# Altium project ZLS_MCU_New.PrjPCB (part 4 of 4)

## Sheet Copy of USB.SchDoc: USB
size A4; DocumentNumber: MB1137; Revision: B-01; SheetNumber: 4; SheetTotal: 6; Project: NUCLEO-XXXXZX
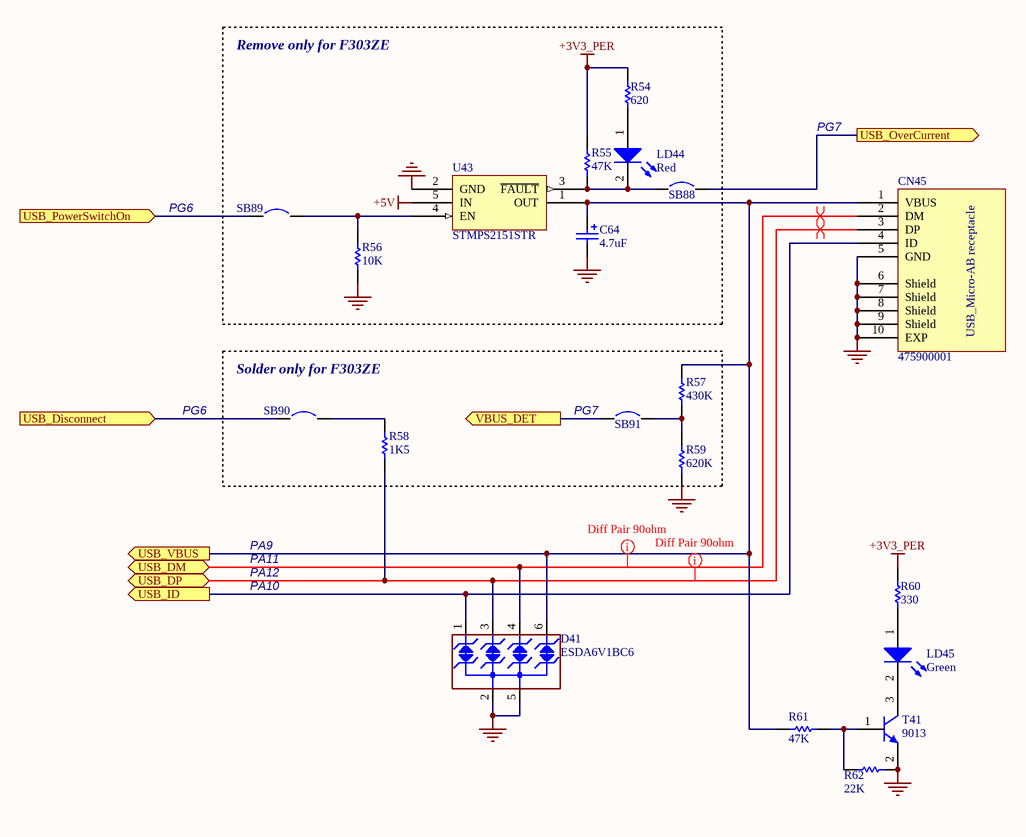
[diagram p9: Copy of USB.SchDoc]

### Parts
C64  4.7uF  [TAN-A]
CN45  475900001  [MOLEX_47590001]
D41  ESDA6V1BC6  [SOT23-6L]
LD44  Red  [0603D-R]
LD45  Green  [0603D-G]
R54  620  [0603R]
R55  47K  [0603R]
R56  10K  [0603R]
R57  430K  [0603R]
R58  1K5  [0603R]
R59  620K  [0603R]
R60  330  [0603R]
R61  47K  [0603R]
R62  22K  [0603R]
SB88  Circuit Breaker  [SB_0603]  (value not drawn)
SB89  Circuit Breaker  [SB_0603]  (value not drawn)
SB90  Circuit Breaker  [SB_0603]  (value not drawn)
SB91  Circuit Breaker  [SB_0603]  (value not drawn)
T41  9013  [SOT-23]
U43  STMPS2151STR  [SOT-23-5L]

### Blocks framed on the sheet
Remove only for F303ZE: C64 LD44 R54-R56 SB88 SB89 U43
Solder only for F303ZE: R57-R59 SB90 SB91

### Ports
USB_Disconnect (in), USB_DM (bidir), USB_DP (bidir), USB_ID (out), USB_OverCurrent (out), USB_PowerSwitchOn (in), USB_VBUS (out), VBUS_DET (out)

### Nets
+3V3_PER: R54.2 R55.1 R60.2
+5V: U43.5(IN)
GND: C64.2 CN45.5(GND) CN45.6(Shield) CN45.7(Shield) CN45.8(Shield) CN45.9(Shield) CN45.10(EXP) D41.2(IO2) D41.5(IO4) R56.1 R59.2 R62.1 T41.2(E) U43.2(GND)
NetC64_1: C64.1 CN45.1(VBUS) D41.6(NC) R57.1 R61.1 U43.1(OUT) ; port USB_VBUS
NetCN45_2: CN45.2(DM) D41.4(IO3) ; port USB_DM
NetCN45_3: CN45.3(DP) D41.3(GND) R58.1 ; port USB_DP
NetCN45_4: CN45.4(ID) D41.1(IO1) ; port USB_ID
NetLD44_1: LD44.1(A) R54.1
NetLD44_2: LD44.2(K) R55.2 SB88.1 U43.3(~{FAULT})
NetLD45_1: LD45.1(A) R60.1
NetLD45_2: LD45.2(K) T41.3(C)
NetR56_2: R56.2 SB89.2 U43.4(EN)
NetR57_2: R57.2 R59.1 SB91.2
NetR58_2: R58.2 SB90.2
NetR61_2: R61.2 R62.2 T41.1(B)
NetSB88_2: SB88.2 ; port USB_OverCurrent
NetSB89_1: SB89.1 ; port USB_PowerSwitchOn
NetSB90_1: SB90.1 ; port USB_Disconnect
NetSB91_1: SB91.1 ; port VBUS_DET

### Layout directives
mark named Diff Pair 90ohm: NetCN45_2, NetCN45_3
differential pair: NetCN45_2, NetCN45_3

### Notes on the sheet
- PG7
- PG6
- (near SB91) PG7
- PA9
- PA12
- PA11
- PA10
- Title:
- Project:
- Size:
- Date:
- A4
- Reference:
- Sheet:
- Revision:
- of
- (in symbol 475900001) USB_Micro-AB receptacle

### Library data of the parts
C64 = Cap Pol1: Polarized Capacitor (Radial); Value: 47uF; Published: 8-Jun-2000; Revision: July-2002: Re-released for DXP Platform.; Publisher: Altium Limited
D41 = ESDA6V1BC6: 4-line ESD protection; Manuf_1: STM; Manuf_Part_1: ESDA5V3L; Ref St: 9179034; Provided: ST; ECCN_US/EU: EAR99/NEC; Distrib: ST; Order: ESDA5V3L; Ordered by: STM
LD44 LD45 = LED2: Typical RED, GREEN, YELLOW, AMBER GaAs LED; Published: 8-Jun-2000; Revision: July-2002: Re-released for DXP Platform.; Publisher: Altium Limited
R54 R56 = Res1: Resistor; Value: 1K; Published: 8-Jun-2000; Revision: July-2002: Re-released for DXP Platform.; Publisher: Altium Limited
R55 R57 R59-R62 = res1: Resistor; Value: 1K; Published: 8-Jun-2000; Revision: July-2002: Re-released for DXP Platform.; Publisher: Altium Limited
R58 = Resistor_ST: Resistor 0402 / 0603 / 0805; Value: 10K
SB88-SB91 = Circuit Breaker: Solder: NO; Published: 24-Mar-1999; Revision: July-2002: Re-released for DXP Platform.; Publisher: Altium Limited
T41 = NPN: NPN Bipolar Transistor; Code - JEDEC: TO-226-AA; Published: 8-Jun-2000; Revision: July-2002: Re-released for DXP Platform.; Publisher: Altium Limited
U43 = STMPS2141STR

## Sheet Copy of ST_LINK_V2-1.SCHDOC: STLINK/V2-1
size A4; DocumentNumber: MB1137; Revision: B-01; SheetNumber: 3; SheetTotal: 6; Project: NUCLEO-XXXXZX
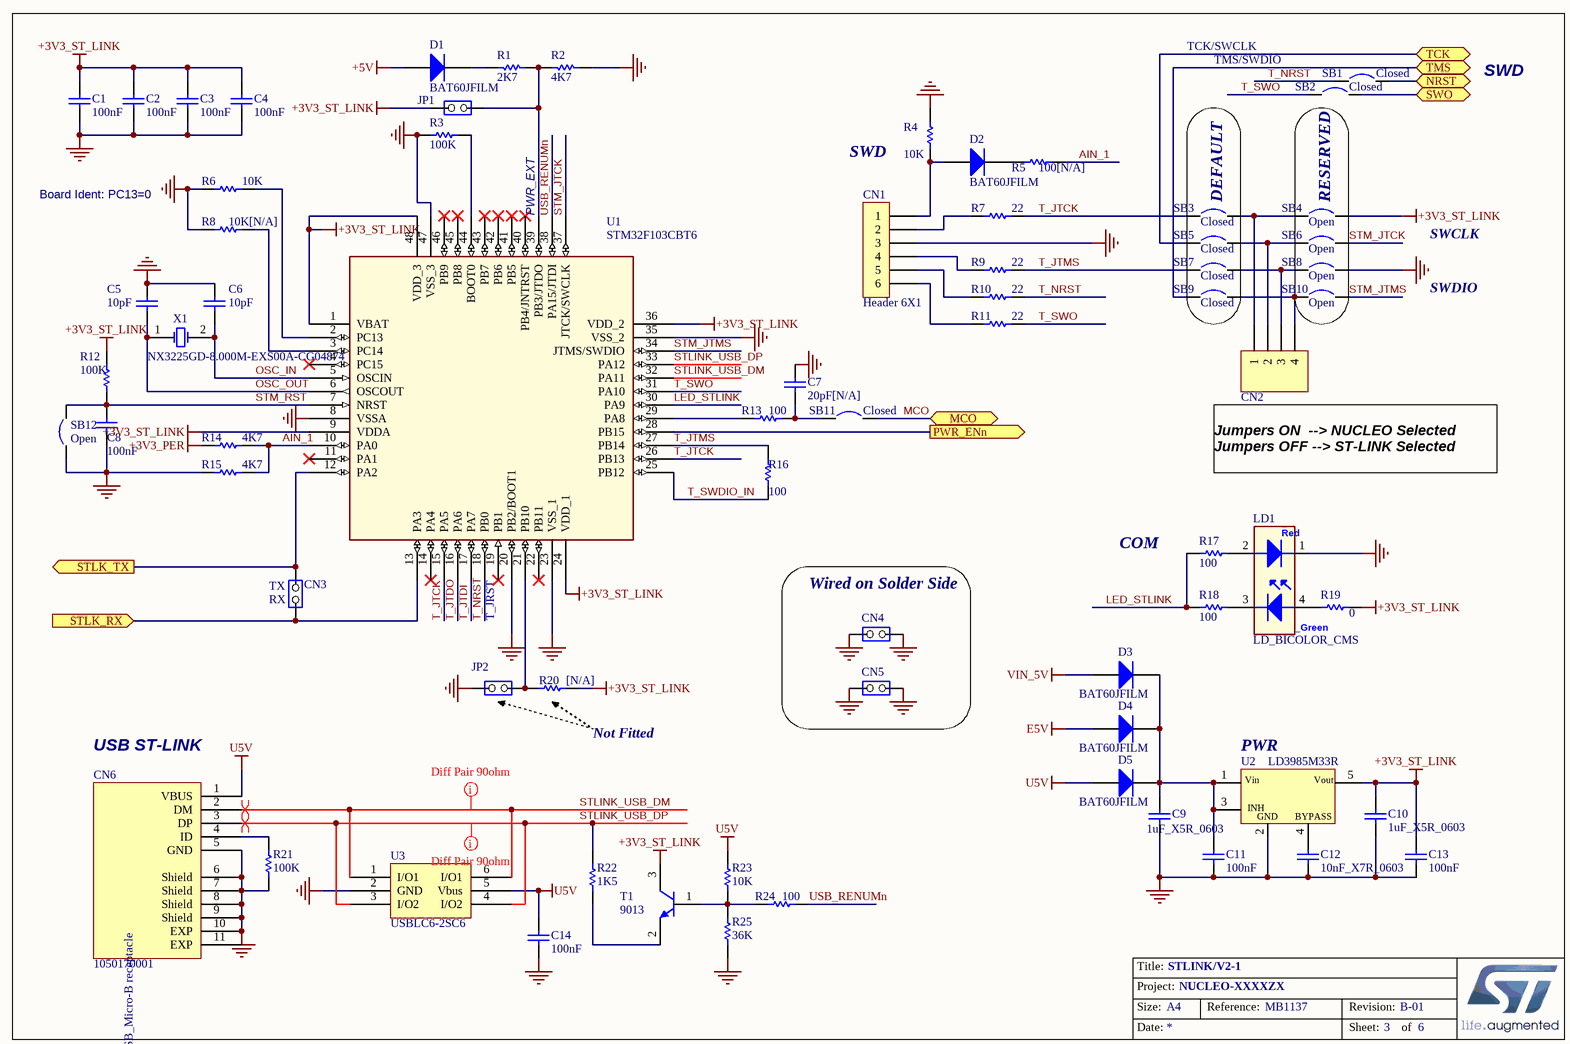
[diagram p10: Copy of ST_LINK_V2-1.SCHDOC]

### Parts
C1  100nF  [0603C]
C2  100nF  [0603C]
C3  100nF  [0603C]
C4  100nF  [0603C]
C5  10pF  [0603C]
C6  10pF  [0603C]
C7  20pF[N/A]  [0603C]
C8  100nF  [0603C]
C9  1uF_X5R_0603  [0603C]
C10  1uF_X5R_0603  [0603C]
C11  100nF  [0603C]
C12  10nF_X7R_0603  [0603C]
C13  100nF  [0603C]
C14  100nF  [0603C]
CN1  Header 6X1  [HDR_1x6_2R54_V_M]
CN2  Header 4  [HDR_1x4_2R54_V_M]  (value not drawn)
CN3  (no value)  [HDR_1x2_2R54_V_M_S]
CN4  (no value)  [HDR_1x2_2R54_V_M]
CN5  (no value)  [HDR_1x2_2R54_V_M]
CN6  1050170001  [Molex_1050170001]
D1  BAT60JFILM  [SOD-323]
D2  BAT60JFILM  [SOD-323]
D3  BAT60JFILM  [SOD-323]
D4  BAT60JFILM  [SOD-323]
D5  BAT60JFILM  [SOD-323]
JP1  (no value)  [HDR_1x2_2R54_V_M_S]
JP2  (no value)  [HDR_1x2_2R54_V_M_S]
LD1  LD_BICOLOR_CMS  [HSMF-A201]
R1  2K7  [0603R]
R2  4K7  [0603R]
R3  100K  [0603R]
R4  10K  [0603R]
R5  100[N/A]  [0603R]
R6  10K  [0603R]
R7  22  [0603R]
R8  10K[N/A]  [0603R]
R9  22  [0603R]
R10  22  [0603R]
R11  22  [0603R]
R12  100K  [0603R]
R13  100  [0603R]
R14  4K7  [0603R]
R15  4K7  [0603R]
R16  100  [0603R]
R17  100  [0603R]
R18  100  [0603R]
R19  0  [0603R]
R20  [N/A]  [0603R]
R21  100K  [0603R]
R22  1K5  [0603R]
R23  10K  [0603R]
R24  100  [0603R]
R25  36K  [0603R]
SB1  Closed  [SB_0603]
SB2  Closed  [SB_0603]
SB3  Closed  [SB_0603]
SB4  Open  [SB_0603]
SB5  Closed  [SB_0603]
SB6  Open  [SB_0603]
SB7  Closed  [SB_0603]
SB8  Open  [SB_0603]
SB9  Closed  [SB_0603]
SB10  Open  [SB_0603]
SB11  Closed  [SB_0603]
SB12  Open  [SB_0603]
T1  9013  [SOT-23]
U1  STM32F103CBT6  [LQFP48_0R5_7x7]
U2  LD3985M33R  [SOT-23-5L]
U3  USBLC6-2SC6  [SOT23-6L]
X1  NX3225GD-8.000M-EXS00A-CG04874  [OSC_2SM_3R2x2R5]

### Blocks framed on the sheet
DEFAULT: SB3 SB5 SB7 SB9
RESERVED: SB4 SB6 SB8 SB10
Wired on Solder Side: CN4 CN5

### Ports
MCO, NRST, PWR_ENn (out), STLK_RX (in), STLK_TX (out), SWO, TCK, TMS

### Nets
+3V3_PER: R14.1
+3V3_ST_LINK: C1.2 C2.2 C3.2 C4.2 C10.1 C13.2 JP1.1(COMMON) R12.2 R19.2 R20.1 SB4.2 T1.3(C) U1.1(VBAT) U1.9(VDDA) U1.24(VDD_1) U1.36(VDD_2) U1.48(VDD_3) U2.5(Vout)
+5V: D1.1(A)
E5V: D4.1(A)
GND: C1.1 C2.1 C3.1 C4.1 C5.2 C6.2 C7.2 C8.1 C9.1 C10.2 C11.1 C12.1 C13.1 C14.1 CN1.3 CN4.1(COMMON) CN4.2(NO) CN5.1(COMMON) CN5.2(NO) CN6.5(GND) CN6.6(Shield) CN6.7(Shield) CN6.8(Shield) CN6.9(Shield) CN6.10(EXP) JP2.1(COMMON) LD1.1 R2.2 R3.1 R4.2 R6.1 R8.1 R15.1 R21.2 R25.1 SB8.2 SB12.1 U1.8(VSSA) U1.20(PB2/BOOT1) U1.23(VSS_1) U1.35(VSS_2) U1.47(VSS_3) U2.2(GND) U3.2(GND)
U5V: C14.2 CN6.1(VBUS) D5.1(A) R23.2 U3.5(Vbus)
VIN_5V: D3.1(A)
AIN_1: R5.2 R14.2 R15.2 U1.10(PA0)
LED_STLINK: R17.1 R18.1 U1.30(PA9)
MCO: SB11.2 ; port MCO
OSC_IN: C6.1 U1.5(OSCIN) X1.2(OSC2)
OSC_OUT: C5.1 U1.6(OSCOUT) X1.1(OSC1)
STLINK_USB_DM: CN6.2(DM) U1.32(PA11) U3.1(I/O1) U3.6(I/O1)
STLINK_USB_DP: CN6.3(DP) R22.1 U1.33(PA12) U3.3(I/O2) U3.4(I/O2)
STM_JTCK: SB6.2 U1.37(JTCK/SWCLK)
STM_JTMS: SB10.2 U1.34(JTMS/SWDIO)
STM_RST: C8.2 R12.1 SB12.2 U1.7(NRST)
T_JTCK: R7.2 SB3.1 U1.15(PA5) U1.26(PB13)
T_JTDI: U1.17(PA7)
T_JTDO: U1.16(PA6)
T_JTMS: R9.2 R16.2 SB7.1 U1.27(PB14)
T_NRST: R10.2 SB1.1 U1.18(PB0)
T_SWDIO_IN: R16.1 U1.25(PB12)
T_SWO: R11.2 SB2.1 U1.31(PA10)
USB_RENUMn: R24.2 U1.38(PA15/JTDI)
NetC7_1: C7.1 R13.2 SB11.1
NetC9_2: C9.2 C11.2 D3.2(K) D4.2(K) D5.2(K) U2.1(Vin) U2.3(CE)
NetC12_2: C12.2 U2.4(BYPASS)
NetCN1_1: CN1.1 D2.1(A) R4.1
NetCN1_2: CN1.2 R7.1
NetCN1_4: CN1.4 R9.1
NetCN1_5: CN1.5 R10.1
NetCN1_6: CN1.6 R11.1
NetCN2_1: CN2.1 SB3.2 SB4.1
NetCN2_2: CN2.2 SB5.2 SB6.1
NetCN2_3: CN2.3 SB7.2 SB8.1
NetCN2_4: CN2.4 SB9.2 SB10.1
NetCN3_1: CN3.1(COMMON) U1.13(PA3) ; port STLK_RX
NetCN3_2: CN3.2(NO) U1.12(PA2) ; port STLK_TX
NetCN6_4: CN6.4(ID) R21.1
NetD1_2: D1.2(K) R1.1
NetD2_2: D2.2(K) R5.1
NetJP1_2: JP1.2(NO) R1.2 R2.1 U1.39(PB3/JTDO)
NetJP2_2: JP2.2(NO) R20.2 U1.21(PB10)
NetLD1_2: LD1.2 R17.2
NetLD1_3: LD1.3 R18.2
NetLD1_4: LD1.4 R19.1
NetR3_2: R3.2 U1.44(BOOT0)
NetR6_2: R6.2 U1.2(PC13)
NetR8_2: R8.2 U1.3(PC14)
NetR13_1: R13.1 U1.29(PA8)
NetR22_2: R22.2 T1.2(E)
NetR23_1: R23.1 R24.1 R25.2 T1.1(B)
NetSB1_2: SB1.2 ; port NRST
NetSB2_2: SB2.2 ; port SWO
NetSB5_1: SB5.1 ; port TCK
NetSB9_1: SB9.1 ; port TMS
NetU1_28: U1.28(PB15) ; port PWR_ENn

Not connected (* = marked no-connect by the designer): CN6 11(EXP); U1 4(PC15)* 11(PA1)* 14(PA4)* 19(PB1)* 22(PB11)* 40(PB4/JNTRST)* 41(PB5)* 42(PB6)* 43(PB7)* 45(PB8)* 46(PB9)*

### Layout directives
differential pair: (no net found under the mark)
mark named Diff Pair 90ohm: STLINK_USB_DM, STLINK_USB_DP

### Notes on the sheet
- TCK/SWCLK
- TMS/SWDIO
- SWD
- Board Ident: PC13=0
- (near U1) PWR_EXT
- SWCLK
- SWDIO
- Jumpers ON  --> NUCLEO Selected
  Jumpers OFF --> ST-LINK Selected
- (near CN3) TX
- COM
- (near CN3) RX
- T_JRST
- (near CN6) USB ST-LINK
- (near R20) Not Fitted
- (near U2) PWR
- Title:
- Project:
- Size:
- Date:
- A4
- Reference:
- Sheet:
- Revision:
- of
- (in symbol 1050170001) USB_Micro-B receptacle
- (in symbol LD3985M33R) INH
- (in symbol LD_BICOLOR_CMS) Red; _Green

### Library data of the parts
C1-C4 C8 C11 C13 C14 = Capacitor_ST: Capacitor 0402 / 0603 / 0805; Revision: July-2002: Re-released for DXP Platform.; Value: 100nF
C5-C7 = Capacitor_ST: Capacitor 0402 / 0603 / 0805; Value: 100nF; Revision: July-2002: Re-released for DXP Platform.
C9 C10 = CAP SMD 0603  X5R 1µF 25V 10%: 0603  X5R 1µF; Rated voltage: 25V; Tolerance: 10%; Manufacturer: *; Manufacturer P/N: *; Order code Farnell: 1288202RL; Value: 1µF; Power: *; Technology: X5R; Temperature  Factor: *; Temperature Max: +125°C; Temperature Min: -55°C; STS Code: *
C12 = CAP SMD 0603  X7R 10000PF 50V 10%: 0603  X7R 10NF; Order code RS: 2040779; Rated voltage: 50V; Tolerance: 10%; Order code Farnell: 7569548RL; Value: 10NF; Power: *; Technology: X7R; Temperature Factor: *; Temperature Min: -55°C; Temperature Max: +125°C; STS Code: *
CN1 = Header 6X1: Header, 6-Pin, Single row; LatestRevisionDate: 17-Jul-2002; LatestRevisionNote: Re-released for DXP Platform.; Publisher: Altium Limited
CN2 = Header 4: Header, 4-Pin, Single row; Revision: 17-Jul-2002: Re-released for DXP Platform.; Publisher: Altium Limited
CN3 = JP2: Fitted: NO
CN4 CN5 JP1 JP2 = JP2
CN6 = 1050170001: Silkscreen: USB
D1 = Diode: Default Diode; Code - JEDEC: DO-214-AB; Ordered by: STM; ECCN_US/EU: EAR99/NEC; Published: 8-Jun-2000; Revision: July-2002: Re-released for DXP Platform.; Publisher: Altium Limited
D2-D5 = BAT60JFILM: Manuf_1: STM; Provided: ST; ECCN_US/EU: EAR99/NEC; Revision: July-2002: Re-released for DXP Platform.; Order: BAT60JFILM; Manuf_Part_1: BAT60JFILM; Distrib: ST
LD1 = LD_BICOLOR_CMS: Bicolor Led; Manuf_Part_1: HSMF-A201-A00J1; Manuf_1: Avago Technologies; Ref St: xxxxxx; cap_dec: ----; Distrib: RADIOSPARES
R1 R2 R20 R23 R25 = Res1: Resistor; Value: 1K; Published: 8-Jun-2000; Revision: July-2002: Re-released for DXP Platform.; Publisher: Altium Limited
R3 R5 R7 R9-R13 R16-R19 R21 R22 R24 = Resistor_ST: Resistor 0402 / 0603 / 0805; Value: 10K
R4 R6 = Resistor_ST: Resistor 0402 / 0603 / 0805; Value: 10K
R8 R14 R15 = Resistor_ST: Resistor 0402 / 0603 / 0805; Value: 10K; Fitted: NO
SB1-SB3 SB5 SB7 SB9 SB11 = Circuit Breaker_close: Circuit Breaker; Published: 24-Mar-1999; Revision: July-2002: Re-released for DXP Platform.; Publisher: Altium Limited
SB4 SB6 SB8 SB10 SB12 = Circuit Breaker: Published: 24-Mar-1999; Revision: July-2002: Re-released for DXP Platform.; Publisher: Altium Limited
T1 = NPN: as T41 on sheet Copy of USB; Published: 8-Jun-2000; Revision: July-2002: Re-released for DXP Platform.; Publisher: Altium Limited
U1 = STM32F103CBT6: Medium-density performance line ARM-based 32-bit MCU with 64KB Flash; Manuf_Part_1: STM32F103C8T6; Manuf_1: STM; Ref St: 9175981; Provided: ST; ECCN_US/EU: 3A991A2/NEC; Footprint: QFP48 7X7; Distrib: ST; Order: STM32F103C8T6
U2 = LD3985M33R: Ultra low drop-low noise BiCMOS voltage, regulators low ESR capacitors compatible; Manuf_1: STM; Provided: ST; Ref St: 9176161; ECCN_US/EU: EAR99/NEC; Manuf_Part_1: LD3985M33R; Distrib: ST; Order: LD3985M33R
X1 = XTAL: Crystal Oscillator; Published: 8-Jun-2000; LatestRevisionDate: 17-Jul-2002; LatestRevisionNote: Re-released for DXP Platform.; PackageReference: R38; Publisher: Altium Limited

## Nets that join several sheets
+3.3: Feedback (U9.5), Power (C80.2 U18.5), Power_Input (R104.2 R105.2)
+3V3: Top (JP4.1 SB14.2 SB15.1), Connectors_1 (CN42.16 P41.1 P41.2 SB41.1)
+3V3_PER: Top (SB15.2), Connectors_1 (SB42.1 U41.5), Copy of USB (R54.2 R55.1 R60.2), Copy of ST_LINK_V2-1 (R14.1)
+5: Feedback (10 pins), Power (7 pins), Signal_Conditioner (6 pins), Heater (8 pins), CT (C96.2 U28.8)
+5V: Top (8 pins), Connectors_1 (CN42.18), Copy of USB (U43.5), Copy of ST_LINK_V2-1 (D1.1)
+12: Feedback (8 pins), Power (R81.1 U15.4), Heater (12 pins), CT (C93.2 C95.2 U26.5 U27.5)
-5: Feedback (5 pins), Power (C72.1 U16.1), Signal_Conditioner (U21.4 U23.4), CT (C99.2 U28.4)
AGND: Connectors_1 (CN43.32), MCU_144_2 (C50.2 SB86.1 SB87.2 U42.31)
AVDD: Connectors_1 (CN43.7), MCU_144_2 (C50.1 SB77.2 U42.32 U42.33)
E5V: Top (JP3.2), Connectors_1 (CN42.6), Copy of ST_LINK_V2-1 (D4.1)
GND: Top (14 pins), Connectors_1 (27 pins), MCU_144_2 (40 pins), Feedback (40 pins), Power (18 pins), Power_Input (11 pins), Signal_Conditioner (8 pins), Heater (14 pins), CT (24 pins), Copy of USB (14 pins), Copy of ST_LINK_V2-1 (44 pins)
U5V: Top (6 pins), Connectors_1 (CN43.8), Copy of ST_LINK_V2-1 (5 pins)
VBAT: Connectors_1 (CN42.33), MCU_144_2 (C49.1 SB80.2 U42.6)
VDD: Top (JP4.2), Connectors_1 (CN42.5), MCU_144_2 (33 pins)
VIN: Top (C15.1 U4.3), Connectors_1 (CN42.24)
VIN_5V: Top (C16.1 JP3.6 U4.2 U4.4), Copy of ST_LINK_V2-1 (D3.1)
ZH: Feedback (9 pins), CT (U25.12 U25.17)
ZP: Feedback (C34.1 P2.7 TP8.1 U10.8), CT (C94.2 U25.16)
Beam_In: Connectors_1 (J41.10), CT (J1.10 R143.2 U28.5)
BOOT0: Connectors_1 (CN42.7), MCU_144_2 (R53.1 U42.138)
NetJ1_1: Connectors_1 (J41.1), CT (J1.1 R134.2)
NetJ1_2: Connectors_1 (J41.2), CT (J1.2 U26.4)
NetJ1_3: Connectors_1 (J41.3), CT (J1.3 R136.2)
NetJ1_4: Connectors_1 (J41.4), CT (J1.4 U27.4)
NetJ1_9: Connectors_1 (J41.9), CT (J1.9)
NRST: Connectors_1 (CN42.14 P41.15), MCU_144_2 (B42.2 B42.3 C46.2 U42.25)
PA0: Connectors_1 (CN42.28), MCU_144_2 (SB55.2 U42.34)
PA1: Connectors_1 (CN42.30), MCU_144_2 (SB56.2 U42.35)
PA2: Connectors_1 (CN43.35), MCU_144_2 (SB58.2 U42.36)
PA3: Connectors_1 (CN43.37), MCU_144_2 (U42.37)
PA4: Connectors_1 (CN42.32), MCU_144_2 (U42.40)
PA5: Connectors_1 (CN43.11 SB54.2), MCU_144_2 (U42.41)
PA6: Connectors_1 (CN43.13), MCU_144_2 (U42.42)
PA7: Connectors_1 (CN43.15), MCU_144_2 (JP41.1 U42.43)
PA8: Connectors_1 (CN43.23), MCU_144_2 (TP41.1 U42.100)
PA9: Connectors_1 (CN43.21), MCU_144_2 (SB62.2 U42.101)
PA10: Connectors_1 (CN43.33), MCU_144_2 (SB64.2 U42.102)
PA11: Connectors_1 (CN43.14), MCU_144_2 (SB65.2 U42.103)
PA12: Connectors_1 (CN43.12), MCU_144_2 (SB66.2 U42.104)
PA13: Connectors_1 (CN42.13), MCU_144_2 (U42.105)
PA14: Connectors_1 (CN42.15), MCU_144_2 (U42.109)
PA15: Connectors_1 (CN42.17), MCU_144_2 (U42.110)
PB0: Connectors_1 (CN42.34 SB53.1), MCU_144_2 (U42.46)
PB1: Connectors_1 (CN43.24), MCU_144_2 (U42.47)
PB2: Connectors_1 (CN43.22), MCU_144_2 (R44.1 U42.48)
PB3: Connectors_1 (CN43.31), MCU_144_2 (U42.133)
PB4: Connectors_1 (CN43.27), MCU_144_2 (U42.134)
PB5: Connectors_1 (CN43.29), MCU_144_2 (U42.135)
PB6: Connectors_1 (CN43.17), MCU_144_2 (U42.136)
PB7: Connectors_1 (CN42.21), MCU_144_2 (SB60.1 U42.137)
PB8: Connectors_1 (CN43.3), MCU_144_2 (U42.139)
PB9: Connectors_1 (CN43.5), MCU_144_2 (U42.140)
PB10: Connectors_1 (CN43.25), MCU_144_2 (U42.69)
PB11: Connectors_1 (CN43.18), MCU_144_2 (U42.70)
PB12: Connectors_1 (CN43.16), MCU_144_2 (U42.73)
PB13: Connectors_1 (CN43.30), MCU_144_2 (JP42.2 U42.74)
PB14: Connectors_1 (CN43.28), MCU_144_2 (SB67.1 U42.75)
PB15: Connectors_1 (CN43.26), MCU_144_2 (U42.76)
PC0: Connectors_1 (CN42.38), MCU_144_2 (U42.26)
PC1: Connectors_1 (CN42.36), MCU_144_2 (SB68.2 U42.27)
PC2: Connectors_1 (CN42.35), MCU_144_2 (U42.28)
PC3: Connectors_1 (CN42.37), MCU_144_2 (U42.29)
PC4: Connectors_1 (CN43.34), MCU_144_2 (SB69.2 U42.44)
PC5: Connectors_1 (CN43.6), MCU_144_2 (SB70.2 U42.45)
PC6: Connectors_1 (CN43.4), MCU_144_2 (U42.96)
PC7: Connectors_1 (CN43.19), MCU_144_2 (U42.97)
PC8: Connectors_1 (SB46.1), MCU_144_2 (U42.98)
PC9: Connectors_1 (SB45.1), MCU_144_2 (U42.99)
PC10: Connectors_1 (CN42.1), MCU_144_2 (U42.111)
PC11: Connectors_1 (CN42.2), MCU_144_2 (U42.112)
PC12: Connectors_1 (CN42.3), MCU_144_2 (U42.113)
PC13: Connectors_1 (CN42.23), MCU_144_2 (SB71.1 U42.7)
PC14: Connectors_1 (SB48.1), MCU_144_2 (R51.2 U42.8)
PC15: Connectors_1 (SB49.1), MCU_144_2 (R50.2 U42.9)
PD0: Connectors_1 (CN42.57), MCU_144_2 (U42.114)
PD1: Connectors_1 (CN42.55), MCU_144_2 (U42.115)
PD2: Connectors_1 (CN42.4), MCU_144_2 (U42.116)
PD3: Connectors_1 (CN42.40), MCU_144_2 (U42.117)
PD4: Connectors_1 (CN42.39), MCU_144_2 (U42.118)
PD5: Connectors_1 (CN42.41), MCU_144_2 (U42.119)
PD6: Connectors_1 (CN42.43), MCU_144_2 (U42.122)
PD7: Connectors_1 (CN42.45), MCU_144_2 (U42.123)
PD8: Connectors_1 (SB47.2), MCU_144_2 (SB61.2 U42.77)
PD9: Connectors_1 (SB52.1), MCU_144_2 (SB63.2 U42.78)
PD10: Connectors_1 (CN43.65), MCU_144_2 (U42.79)
PD11: Connectors_1 (CN43.45), MCU_144_2 (U42.80)
PD12: Connectors_1 (CN43.43), MCU_144_2 (U42.81)
PD13: Connectors_1 (CN43.41), MCU_144_2 (U42.82)
PD14: Connectors_1 (CN43.46), MCU_144_2 (U42.85)
PD15: Connectors_1 (CN43.48), MCU_144_2 (U42.86)
PE0: Connectors_1 (CN43.64), MCU_144_2 (U42.141)
PE1: Connectors_1 (CN42.61), MCU_144_2 (U42.142)
PE2: Connectors_1 (CN42.46), MCU_144_2 (U42.1)
PE3: Connectors_1 (CN42.47), MCU_144_2 (U42.2)
PE4: Connectors_1 (CN42.48), MCU_144_2 (U42.3)
PE5: Connectors_1 (CN42.50), MCU_144_2 (U42.4)
PE6: Connectors_1 (CN42.62), MCU_144_2 (U42.5)
PE7: Connectors_1 (CN43.44), MCU_144_2 (U42.58)
PE8: Connectors_1 (CN43.40), MCU_144_2 (U42.59)
PE9: Connectors_1 (CN43.52), MCU_144_2 (U42.60)
PE10: Connectors_1 (CN43.47), MCU_144_2 (U42.63)
PE11: Connectors_1 (CN43.56), MCU_144_2 (U42.64)
PE12: Connectors_1 (CN43.49), MCU_144_2 (U42.65)
PE13: Connectors_1 (CN43.55), MCU_144_2 (U42.66)
PE14: Connectors_1 (CN43.51), MCU_144_2 (U42.67)
PE15: Connectors_1 (CN43.53), MCU_144_2 (U42.68)
PF0: Connectors_1 (CN42.53), MCU_144_2 (U42.10)
PF1: Connectors_1 (CN42.51), MCU_144_2 (U42.11)
PF2: Connectors_1 (CN42.52), MCU_144_2 (U42.12)
PF3: Connectors_1 (CN43.58), MCU_144_2 (U42.13)
PF4: Connectors_1 (CN43.38), MCU_144_2 (U42.14)
PF5: Connectors_1 (CN43.36), MCU_144_2 (U42.15)
PF6: Connectors_1 (CN42.9), MCU_144_2 (U42.18)
PF7: Connectors_1 (CN42.11), MCU_144_2 (U42.19)
PF8: Connectors_1 (CN42.54), MCU_144_2 (U42.20)
PF9: Connectors_1 (CN42.56), MCU_144_2 (U42.21)
PF10: Connectors_1 (CN43.42), MCU_144_2 (U42.22)
PF11: Connectors_1 (CN43.62), MCU_144_2 (U42.49)
PF12: Connectors_1 (CN43.59), MCU_144_2 (U42.50)
PF13: Connectors_1 (CN43.57), MCU_144_2 (U42.53)
PF14: Connectors_1 (CN43.50), MCU_144_2 (U42.54)
PF15: Connectors_1 (CN43.60), MCU_144_2 (U42.55)
PG0: Connectors_1 (CN42.59), MCU_144_2 (U42.56)
PG1: Connectors_1 (CN42.58), MCU_144_2 (U42.57)
PG2: Connectors_1 (CN42.42), MCU_144_2 (U42.87)
PG3: Connectors_1 (CN42.44), MCU_144_2 (U42.88)
PG4: Connectors_1 (CN43.69), MCU_144_2 (U42.89)
PG5: Connectors_1 (CN43.68), MCU_144_2 (U42.90)
PG6: Connectors_1 (CN43.70), MCU_144_2 (U42.91)
PG7: Connectors_1 (CN43.67), MCU_144_2 (JP43.2 U42.92)
PG8: Connectors_1 (CN43.66), MCU_144_2 (U42.93)
PG9: Connectors_1 (CN42.63), MCU_144_2 (U42.124)
PG10: Connectors_1 (CN42.66), MCU_144_2 (U42.125)
PG11: Connectors_1 (CN42.70), MCU_144_2 (SB72.1 U42.126)
PG12: Connectors_1 (CN42.65), MCU_144_2 (U42.127)
PG13: Connectors_1 (CN42.68), MCU_144_2 (SB73.1 U42.128)
PG14: Connectors_1 (CN43.61), MCU_144_2 (U42.129)
PG15: Connectors_1 (CN42.64), MCU_144_2 (U42.132)
PH0: Connectors_1 (SB50.1), MCU_144_2 (SB74.2 SB75.2 U42.23)
PH1: Connectors_1 (SB51.1), MCU_144_2 (SB76.2 U42.24)
PH2: Connectors_1 (CN42.67), MCU_144_2 (SB78.2)